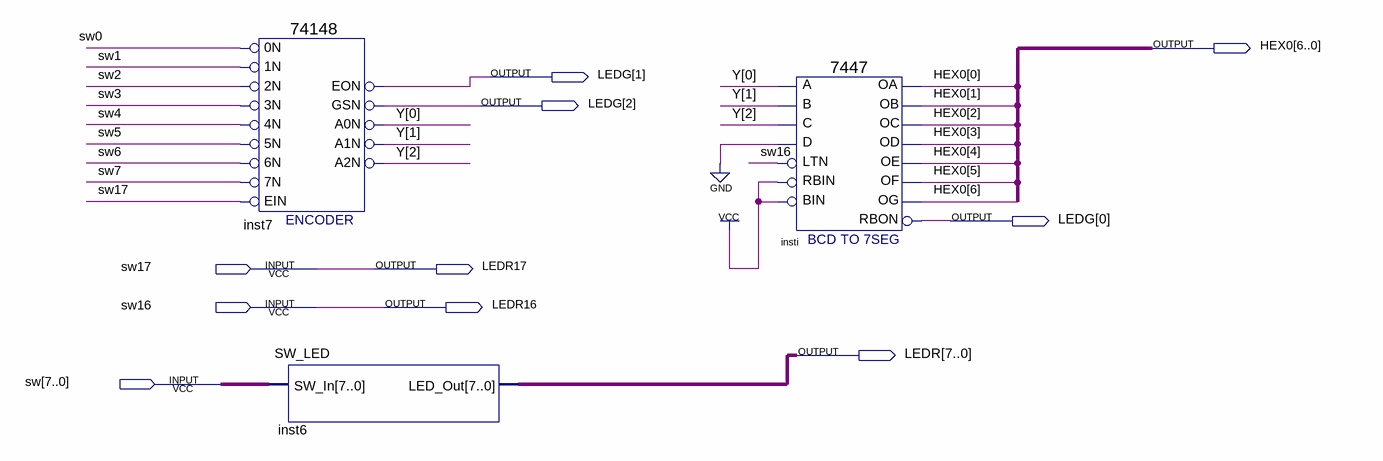
[diagram p0: schematic sheet]
// Quartus schematic display3_8_7.bdf as structural Verilog: 3 symbols, 10 pins
module display3_8_7 (
  input  sw17,
  input  sw16,
  input  [7:0] sw,
  output [6:0] HEX0,
  output [2:0] LEDG,
  output LEDR17,
  output LEDR16,
  output [7:0] LEDR
);

  wire [2:0] Y;

  \74148  inst7 (
    .\5N (sw[5]), .\0N (sw[0]), .\1N (sw[1]), .\2N (sw[2]), .\3N (sw[3]), .\4N (sw[4]), .EIN(sw17),
    .\6N (sw[6]), .\7N (sw[7]), .A1N(Y[1]), .A0N(Y[0]), .A2N(Y[2]), .EON(LEDG[1]), .GSN(LEDG[2]));
  SW_LED inst6 (.SW_In(sw), .LED_Out(LEDR));
  \7447  insti (
    .LTN(sw16), .B(Y[1]), .C(Y[2]), .D(1'b0), .RBIN(1'b1), .BIN(1'b1), .A(Y[0]), .OB(HEX0[1]), .OC(HEX0[2]),
    .OE(HEX0[4]), .OD(HEX0[3]), .OF(HEX0[5]), .OG(HEX0[6]), .OA(HEX0[0]), .RBON(LEDG[0]));

  assign LEDR16 = sw16;
  assign LEDR17 = sw17;
endmodule
